# Altium schematic sheet mx8m_dram.SchDoc
size A3; SheetNumber: 5; SheetTotal: 15
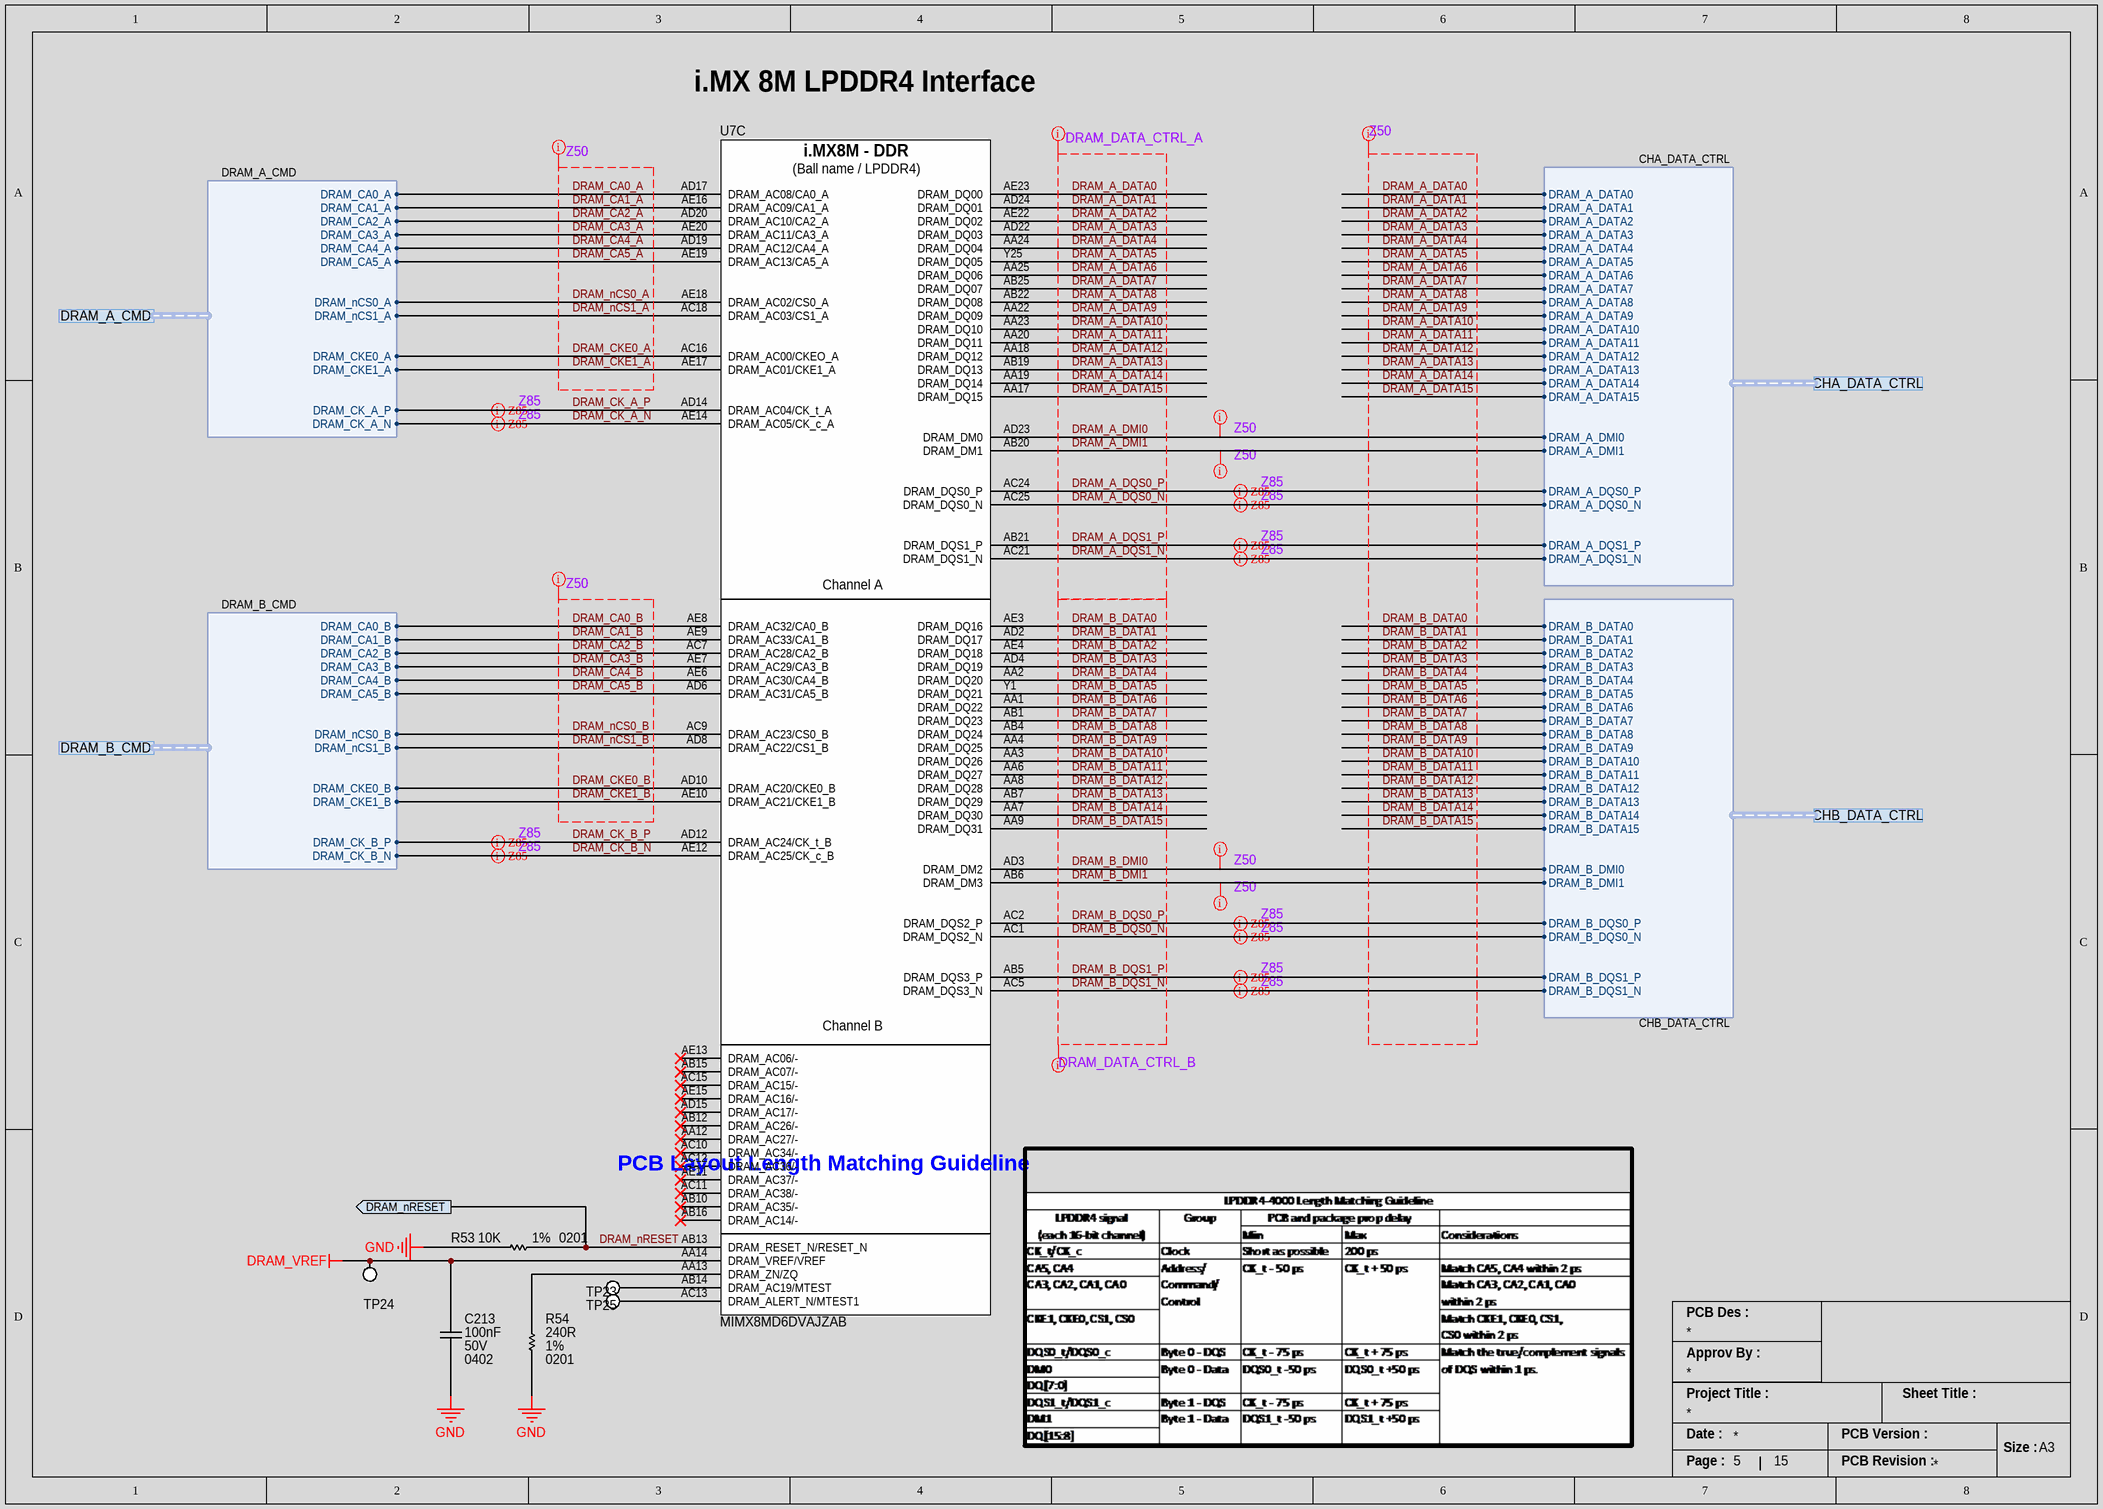
[diagram p0: mx8m_dram.SchDoc]

## Parts
C213  Voltage Rating: 50V  Capacitance: 100nF  Case/Package: 0402  [CAP_0402_CAPC1005X05N]  (hidden comment: GRM155R71H104KE14D)
R53  Tolerance: 1%  Resistance: 10K  Case Code (Imperial): 0201  [RES_0201_RESC0603X02N]  (hidden comment: RC0201FR-0710KL)
R54  Tolerance: 1%  Resistance: 240R  Case/Package: 0201  [RES_0201_RESC0603X02N]  (hidden comment: RC0201FR-07240RL)
TP23  NO COMPONENT  [TP_PAD_1.6MM_SMD_ROUND]  (value not drawn)  (no BOM)
TP24  NO COMPONENT  [TP_PAD_1.6MM_SMD_ROUND]  (value not drawn)  (no BOM)
TP25  NO COMPONENT  [TP_PAD_1.6MM_SMD_ROUND]  (value not drawn)  (no BOM)
U7  MIMX8MD6DVAJZAB  [IC_MPU_BGA621C65P25X25_1700X1700X218]  (part C of 14)

## Ports
CHA_DATA_CTRL (harness CHA_DATA_CTRL), CHB_DATA_CTRL (harness CHB_DATA_CTRL), DRAM_A_CMD (harness DRAM_A_CMD), DRAM_B_CMD (harness DRAM_B_CMD), DRAM_nRESET (out)

## Harnesses
DRAM_A_CMD: DRAM_CA0_A, DRAM_CA1_A, DRAM_CA2_A, DRAM_CA3_A, DRAM_CA4_A, DRAM_CA5_A, DRAM_nCS0_A, DRAM_nCS1_A, DRAM_CKE0_A, DRAM_CKE1_A, DRAM_CK_A_P, DRAM_CK_A_N
DRAM_B_CMD: DRAM_CA0_B, DRAM_CA1_B, DRAM_CA2_B, DRAM_CA3_B, DRAM_CA4_B, DRAM_CA5_B, DRAM_nCS0_B, DRAM_nCS1_B, DRAM_CKE0_B, DRAM_CKE1_B, DRAM_CK_B_P, DRAM_CK_B_N
CHA_DATA_CTRL: DRAM_A_DATA0, DRAM_A_DATA1, DRAM_A_DATA2, DRAM_A_DATA3, DRAM_A_DATA4, DRAM_A_DATA5, DRAM_A_DATA6, DRAM_A_DATA7, DRAM_A_DATA8, DRAM_A_DATA9, DRAM_A_DATA10, DRAM_A_DATA11, DRAM_A_DATA12, DRAM_A_DATA13, DRAM_A_DATA14, DRAM_A_DATA15, DRAM_A_DMI0, DRAM_A_DMI1, DRAM_A_DQS0_P, DRAM_A_DQS0_N, DRAM_A_DQS1_P, DRAM_A_DQS1_N
CHB_DATA_CTRL: DRAM_B_DATA0, DRAM_B_DATA1, DRAM_B_DATA2, DRAM_B_DATA3, DRAM_B_DATA4, DRAM_B_DATA5, DRAM_B_DATA6, DRAM_B_DATA7, DRAM_B_DATA8, DRAM_B_DATA9, DRAM_B_DATA10, DRAM_B_DATA11, DRAM_B_DATA12, DRAM_B_DATA13, DRAM_B_DATA14, DRAM_B_DATA15, DRAM_B_DMI0, DRAM_B_DMI1, DRAM_B_DQS0_P, DRAM_B_DQS0_N, DRAM_B_DQS1_P, DRAM_B_DQS1_N

## Nets
DRAM_VREF: C213.2 TP24.1 U7.AA14(DRAM_VREF/VREF)
GND: C213.1 R53.1 R54.1
DRAM_A_DATA0: U7.AE23(DRAM_DQ00) ; port CHA_DATA_CTRL.DRAM_A_DATA0
DRAM_A_DATA1: U7.AD24(DRAM_DQ01) ; port CHA_DATA_CTRL.DRAM_A_DATA1
DRAM_A_DATA2: U7.AE22(DRAM_DQ02) ; port CHA_DATA_CTRL.DRAM_A_DATA2
DRAM_A_DATA3: U7.AD22(DRAM_DQ03) ; port CHA_DATA_CTRL.DRAM_A_DATA3
DRAM_A_DATA4: U7.AA24(DRAM_DQ04) ; port CHA_DATA_CTRL.DRAM_A_DATA4
DRAM_A_DATA5: U7.Y25(DRAM_DQ05) ; port CHA_DATA_CTRL.DRAM_A_DATA5
DRAM_A_DATA6: U7.AA25(DRAM_DQ06) ; port CHA_DATA_CTRL.DRAM_A_DATA6
DRAM_A_DATA7: U7.AB25(DRAM_DQ07) ; port CHA_DATA_CTRL.DRAM_A_DATA7
DRAM_A_DATA8: U7.AB22(DRAM_DQ08) ; port CHA_DATA_CTRL.DRAM_A_DATA8
DRAM_A_DATA9: U7.AA22(DRAM_DQ09) ; port CHA_DATA_CTRL.DRAM_A_DATA9
DRAM_A_DATA10: U7.AA23(DRAM_DQ10) ; port CHA_DATA_CTRL.DRAM_A_DATA10
DRAM_A_DATA11: U7.AA20(DRAM_DQ11) ; port CHA_DATA_CTRL.DRAM_A_DATA11
DRAM_A_DATA12: U7.AA18(DRAM_DQ12) ; port CHA_DATA_CTRL.DRAM_A_DATA12
DRAM_A_DATA13: U7.AB19(DRAM_DQ13) ; port CHA_DATA_CTRL.DRAM_A_DATA13
DRAM_A_DATA14: U7.AA19(DRAM_DQ14) ; port CHA_DATA_CTRL.DRAM_A_DATA14
DRAM_A_DATA15: U7.AA17(DRAM_DQ15) ; port CHA_DATA_CTRL.DRAM_A_DATA15
DRAM_A_DMI0: U7.AD23(DRAM_DM0) ; port CHA_DATA_CTRL.DRAM_A_DMI0
DRAM_A_DMI1: U7.AB20(DRAM_DM1) ; port CHA_DATA_CTRL.DRAM_A_DMI1
DRAM_A_DQS0_N: U7.AC25(DRAM_DQS0_N) ; port CHA_DATA_CTRL.DRAM_A_DQS0_N
DRAM_A_DQS0_P: U7.AC24(DRAM_DQS0_P) ; port CHA_DATA_CTRL.DRAM_A_DQS0_P
DRAM_A_DQS1_N: U7.AC21(DRAM_DQS1_N) ; port CHA_DATA_CTRL.DRAM_A_DQS1_N
DRAM_A_DQS1_P: U7.AB21(DRAM_DQS1_P) ; port CHA_DATA_CTRL.DRAM_A_DQS1_P
DRAM_B_DATA0: U7.AE3(DRAM_DQ16) ; port CHB_DATA_CTRL.DRAM_B_DATA0
DRAM_B_DATA1: U7.AD2(DRAM_DQ17) ; port CHB_DATA_CTRL.DRAM_B_DATA1
DRAM_B_DATA2: U7.AE4(DRAM_DQ18) ; port CHB_DATA_CTRL.DRAM_B_DATA2
DRAM_B_DATA3: U7.AD4(DRAM_DQ19) ; port CHB_DATA_CTRL.DRAM_B_DATA3
DRAM_B_DATA4: U7.AA2(DRAM_DQ20) ; port CHB_DATA_CTRL.DRAM_B_DATA4
DRAM_B_DATA5: U7.Y1(DRAM_DQ21) ; port CHB_DATA_CTRL.DRAM_B_DATA5
DRAM_B_DATA6: U7.AA1(DRAM_DQ22) ; port CHB_DATA_CTRL.DRAM_B_DATA6
DRAM_B_DATA7: U7.AB1(DRAM_DQ23) ; port CHB_DATA_CTRL.DRAM_B_DATA7
DRAM_B_DATA8: U7.AB4(DRAM_DQ24) ; port CHB_DATA_CTRL.DRAM_B_DATA8
DRAM_B_DATA9: U7.AA4(DRAM_DQ25) ; port CHB_DATA_CTRL.DRAM_B_DATA9
DRAM_B_DATA10: U7.AA3(DRAM_DQ26) ; port CHB_DATA_CTRL.DRAM_B_DATA10
DRAM_B_DATA11: U7.AA6(DRAM_DQ27) ; port CHB_DATA_CTRL.DRAM_B_DATA11
DRAM_B_DATA12: U7.AA8(DRAM_DQ28) ; port CHB_DATA_CTRL.DRAM_B_DATA12
DRAM_B_DATA13: U7.AB7(DRAM_DQ29) ; port CHB_DATA_CTRL.DRAM_B_DATA13
DRAM_B_DATA14: U7.AA7(DRAM_DQ30) ; port CHB_DATA_CTRL.DRAM_B_DATA14
DRAM_B_DATA15: U7.AA9(DRAM_DQ31) ; port CHB_DATA_CTRL.DRAM_B_DATA15
DRAM_B_DMI0: U7.AD3(DRAM_DM2) ; port CHB_DATA_CTRL.DRAM_B_DMI0
DRAM_B_DMI1: U7.AB6(DRAM_DM3) ; port CHB_DATA_CTRL.DRAM_B_DMI1
DRAM_B_DQS0_N: U7.AC1(DRAM_DQS2_N) ; port CHB_DATA_CTRL.DRAM_B_DQS0_N
DRAM_B_DQS0_P: U7.AC2(DRAM_DQS2_P) ; port CHB_DATA_CTRL.DRAM_B_DQS0_P
DRAM_B_DQS1_N: U7.AC5(DRAM_DQS3_N) ; port CHB_DATA_CTRL.DRAM_B_DQS1_N
DRAM_B_DQS1_P: U7.AB5(DRAM_DQS3_P) ; port CHB_DATA_CTRL.DRAM_B_DQS1_P
DRAM_CA0_A: U7.AD17(DRAM_AC08/CA0_A) ; port DRAM_A_CMD.DRAM_CA0_A
DRAM_CA0_B: U7.AE8(DRAM_AC32/CA0_B) ; port DRAM_B_CMD.DRAM_CA0_B
DRAM_CA1_A: U7.AE16(DRAM_AC09/CA1_A) ; port DRAM_A_CMD.DRAM_CA1_A
DRAM_CA1_B: U7.AE9(DRAM_AC33/CA1_B) ; port DRAM_B_CMD.DRAM_CA1_B
DRAM_CA2_A: U7.AD20(DRAM_AC10/CA2_A) ; port DRAM_A_CMD.DRAM_CA2_A
DRAM_CA2_B: U7.AC7(DRAM_AC28/CA2_B) ; port DRAM_B_CMD.DRAM_CA2_B
DRAM_CA3_A: U7.AE20(DRAM_AC11/CA3_A) ; port DRAM_A_CMD.DRAM_CA3_A
DRAM_CA3_B: U7.AE7(DRAM_AC29/CA3_B) ; port DRAM_B_CMD.DRAM_CA3_B
DRAM_CA4_A: U7.AD19(DRAM_AC12/CA4_A) ; port DRAM_A_CMD.DRAM_CA4_A
DRAM_CA4_B: U7.AE6(DRAM_AC30/CA4_B) ; port DRAM_B_CMD.DRAM_CA4_B
DRAM_CA5_A: U7.AE19(DRAM_AC13/CA5_A) ; port DRAM_A_CMD.DRAM_CA5_A
DRAM_CA5_B: U7.AD6(DRAM_AC31/CA5_B) ; port DRAM_B_CMD.DRAM_CA5_B
DRAM_CK_A_N: U7.AE14(DRAM_AC05/CK_c_A) ; port DRAM_A_CMD.DRAM_CK_A_N
DRAM_CK_A_P: U7.AD14(DRAM_AC04/CK_t_A) ; port DRAM_A_CMD.DRAM_CK_A_P
DRAM_CK_B_N: U7.AE12(DRAM_AC25/CK_c_B) ; port DRAM_B_CMD.DRAM_CK_B_N
DRAM_CK_B_P: U7.AD12(DRAM_AC24/CK_t_B) ; port DRAM_B_CMD.DRAM_CK_B_P
DRAM_CKE0_A: U7.AC16(DRAM_AC00/CKEO_A) ; port DRAM_A_CMD.DRAM_CKE0_A
DRAM_CKE0_B: U7.AD10(DRAM_AC20/CKE0_B) ; port DRAM_B_CMD.DRAM_CKE0_B
DRAM_CKE1_A: U7.AE17(DRAM_AC01/CKE1_A) ; port DRAM_A_CMD.DRAM_CKE1_A
DRAM_CKE1_B: U7.AE10(DRAM_AC21/CKE1_B) ; port DRAM_B_CMD.DRAM_CKE1_B
DRAM_nCS0_A: U7.AE18(DRAM_AC02/CS0_A) ; port DRAM_A_CMD.DRAM_nCS0_A
DRAM_nCS0_B: U7.AC9(DRAM_AC23/CS0_B) ; port DRAM_B_CMD.DRAM_nCS0_B
DRAM_nCS1_A: U7.AC18(DRAM_AC03/CS1_A) ; port DRAM_A_CMD.DRAM_nCS1_A
DRAM_nCS1_B: U7.AD8(DRAM_AC22/CS1_B) ; port DRAM_B_CMD.DRAM_nCS1_B
DRAM_nRESET: R53.2 U7.AB13(DRAM_RESET_N/RESET_N) ; port DRAM_nRESET
NetR54_2: R54.2 U7.AA13(DRAM_ZN/ZQ)
NetTP23_1: TP23.1 U7.AB14(DRAM_AC19/MTEST)
NetTP25_1: TP25.1 U7.AC13(DRAM_ALERT_N/MTEST1)

Not connected (* = marked no-connect by the designer): U7 AA12(DRAM_AC27/-)* AB10(DRAM_AC35/-)* AB12(DRAM_AC26/-)* AB15(DRAM_AC07/-)* AB16(DRAM_AC14/-)* AC10(DRAM_AC34/-)* AC11(DRAM_AC38/-)* AC12(DRAM_AC36/-)* AC15(DRAM_AC15/-)* AD15(DRAM_AC17/-)* AE11(DRAM_AC37/-)* AE13(DRAM_AC06/-)* AE15(DRAM_AC16/-)*

## Layout directives
differential pair; net class Z85; differential pair class Z85: DRAM_A_DQS0_N, DRAM_A_DQS0_P, DRAM_A_DQS1_N, DRAM_A_DQS1_P, DRAM_B_DQS0_N, DRAM_B_DQS0_P, DRAM_B_DQS1_N, DRAM_B_DQS1_P, DRAM_CK_A_N, DRAM_CK_A_P, DRAM_CK_B_N, DRAM_CK_B_P
net class Z50: DRAM_A_DATA0, DRAM_A_DATA1, DRAM_A_DATA2, DRAM_A_DATA3, DRAM_A_DATA4, DRAM_A_DATA5, DRAM_A_DATA6, DRAM_A_DATA7, DRAM_A_DATA8, DRAM_A_DATA9, DRAM_A_DATA10, DRAM_A_DATA11, DRAM_A_DATA12, DRAM_A_DATA13, DRAM_A_DATA14, DRAM_A_DATA15, DRAM_A_DMI0, DRAM_A_DMI1, DRAM_B_DATA0, DRAM_B_DATA1, DRAM_B_DATA2, DRAM_B_DATA3, DRAM_B_DATA4, DRAM_B_DATA5, DRAM_B_DATA6, DRAM_B_DATA7, DRAM_B_DATA8, DRAM_B_DATA9, DRAM_B_DATA10, DRAM_B_DATA11, DRAM_B_DATA12, DRAM_B_DATA13, DRAM_B_DATA14, DRAM_B_DATA15, DRAM_B_DMI0, DRAM_B_DMI1, DRAM_CA0_A, DRAM_CA0_B, DRAM_CA1_A, DRAM_CA1_B, DRAM_CA2_A, DRAM_CA2_B, DRAM_CA3_A, DRAM_CA3_B, DRAM_CA4_A, DRAM_CA4_B, DRAM_CA5_A, DRAM_CA5_B, DRAM_CKE0_A, DRAM_CKE0_B, DRAM_CKE1_A, DRAM_CKE1_B, DRAM_nCS0_A, DRAM_nCS0_B, DRAM_nCS1_A, DRAM_nCS1_B
net class DRAM_DATA_CTRL_A: DRAM_A_DATA0, DRAM_A_DATA1, DRAM_A_DATA2, DRAM_A_DATA3, DRAM_A_DATA4, DRAM_A_DATA5, DRAM_A_DATA6, DRAM_A_DATA7, DRAM_A_DATA8, DRAM_A_DATA9, DRAM_A_DATA10, DRAM_A_DATA11, DRAM_A_DATA12, DRAM_A_DATA13, DRAM_A_DATA14, DRAM_A_DATA15, DRAM_A_DMI0, DRAM_A_DMI1, DRAM_A_DQS0_N, DRAM_A_DQS0_P, DRAM_A_DQS1_N, DRAM_A_DQS1_P
net class DRAM_DATA_CTRL_B: DRAM_B_DATA0, DRAM_B_DATA1, DRAM_B_DATA2, DRAM_B_DATA3, DRAM_B_DATA4, DRAM_B_DATA5, DRAM_B_DATA6, DRAM_B_DATA7, DRAM_B_DATA8, DRAM_B_DATA9, DRAM_B_DATA10, DRAM_B_DATA11, DRAM_B_DATA12, DRAM_B_DATA13, DRAM_B_DATA14, DRAM_B_DATA15, DRAM_B_DMI0, DRAM_B_DMI1, DRAM_B_DQS0_N, DRAM_B_DQS0_P, DRAM_B_DQS1_N, DRAM_B_DQS1_P

## Notes on the sheet
- i.MX 8M LPDDR4 Interface
- (near U7) PCB Layout Length Matching Guideline
- PCB Des :
- Approv By :
- Project Title :
- Sheet Title :
- Date :
- PCB Version :
- Size :
- A3
- Page :
- PCB Revision :
- (in symbol IC_MPU_ARM_1.5GHZ_MIMX8MD6DVAJZAB, part C) i.MX8M - DDR; (Ball name / LPDDR4); Channel A; Channel B

## Library data of the parts
C213 = CAP_100NF_50V_X7R_0402: Multilayer Ceramic Capacitor, 0.1 uF, 16 V, ± 10%, X7R, 0402 [1005 Metric]; Manufacturer: Murata; Dissipation Factor: 0.025%; Temperature Coefficient: 30ppm/°C; Supplier 1: DigiKey; Manufacturer Part Number: GRM155R71H104KE14D; RoHS: Yes; Category: Ceramic Capacitors; Stock 1: 13730790; Pricing 1: 1=0.1, 10=0.023, 50=0.0132, 100=0.0102, 500=0.00768, 1000=0.00603, 2500=0.00548, 5000=0.00504 (USD); Mount: Surface Mount; Number of Pins: 2NUMBER; Case Code (Metric): 1005; Material: Ceramic; Case Code (Imperial): 0402; Weight: 0.000212oz; Dielectric Material: Ceramic; Min Operating Temperature: -55°C; Max Operating Temperature: 125°C; Packaging: Tape and Reel; Package Quantity: 10000; Series: GRM; Tolerance: 10%; Dielectric: X7R; Termination: SMD/SMT; Voltage: 50V; Voltage Rating (DC): 50V; Construction: Flat; Length: 1mm; Width: 0.5mm; Height: 0.5mm; Depth: 0.5mm; Thickness: 0.022inch; Reach SVHC Compliant: No; RoHS Compliant: Yes; Lead Free: 5697LeadFree; ComponentLink1URL: http://www.farnell.com/datasheets/2079156.pdf?src-supplier=Farnell; ComponentLink1Description: http://www.farnell.com/datasheets/2079156.pdf?src-supplier=Farnell; ComponentLink2URL: http://www.mouser.com/ds/2/281/c02e-2905.pdf?src-supplier=Mouser; ComponentLink2Description: http://www.mouser.com/ds/2/281/c02e-2905.pdf?src-supplier=Mouser; ComponentLink3URL: http://www.farnell.com/datasheets/2079156.pdf?src-supplier=Newark; ComponentLink3Description: http://www.farnell.com/datasheets/2079156.pdf?src-supplier=Newark; ComponentLink4URL: https://datasheet.octopart.com/GRM155R71H104KE14D-Murata-datasheet-22122223.pdf?src-supplier=Future+Electronics; ComponentLink4Description: https://datasheet.octopart.com/GRM155R71H104KE14D-Murata-datasheet-22122223.pdf?src-supplier=Future+Electronics; ComponentLink5URL: https://search.murata.co.jp/Ceramy/image/img/A01X/G101/ENG/GRM155R71H104KE14-01.pdf?src-supplier=Digi-Key; ComponentLink5Description: https://search.murata.co.jp/Ceramy/image/img/A01X/G101/ENG/GRM155R71H104KE14-01.pdf?src-supplier=Digi-Key; ComponentLink6URL: http://psearch.en.murata.com/capacitor/product/GRM155R71H104KE14%23.pdf?src-supplier=Avnet; ComponentLink6Description: http://psearch.en.murata.com/capacitor/product/GRM155R71H104KE14%23.pdf?src-supplier=Avnet; ComponentLink7URL: https://datasheet.octopart.com/GRM155R71H104KE14D-Murata-datasheet-66077078.pdf?src-supplier=Element14; ComponentLink7Description: https://datasheet.octopart.com/GRM155R71H104KE14D-Murata-datasheet-66077078.pdf?src-supplier=Element14; Supplier Part Number 1: 490-10700-6-ND; Supplier 2: Digikey; Stock 2: 3706055; Pricing 2: 1=0.1, 10=0.037, 50=0.021, 100=0.0162, 500=0.01224, 1000=0.00961, 2500=0.00874, 5000=0.00804 (USD); Halogen Free: 5694HalogenFree; ComponentLink8URL: http://www.mouser.com/ds/2/447/UPY-GPHC_X5R_4V-to-50V_25-1131599.pdf?src-supplier=Mouser; ComponentLink8Description: http://www.mouser.com/ds/2/447/UPY-GPHC_X5R_4V-to-50V_25-1131599.pdf?src-supplier=Mouser; ComponentLink9URL: https://datasheet.octopart.com/CC0402KRX5R8BB104-Yageo-datasheet-137700082.pdf?src-supplier=Future+Electronics; ComponentLink9Description: https://datasheet.octopart.com/CC0402KRX5R8BB104-Yageo-datasheet-137700082.pdf?src-supplier=Future+Electronics; ComponentLink10URL: http://www.yageo.com/documents/recent/UPY-GPHC_X5R_4V-to-50V_25.pdf?src-supplier=Digikey; ComponentLink10Description: http://www.yageo.com/documents/recent/UPY-GPHC_X5R_4V-to-50V_25.pdf?src-supplier=Digikey; ComponentLink11URL: https://datasheet.octopart.com/CC0402KRX5R8BB104-Yageo-datasheet-140260304.pdf?src-supplier=Newark; ComponentLink11Description: https://datasheet.octopart.com/CC0402KRX5R8BB104-Yageo-datasheet-140260304.pdf?src-supplier=Newark; ComponentLink12URL: https://datasheet.octopart.com/CC0402KRX5R8BB104-Yageo-datasheet-170350636.pdf?src-supplier=Future+Electronics; ComponentLink12Description: https://datasheet.octopart.com/CC0402KRX5R8BB104-Yageo-datasheet-170350636.pdf?src-supplier=Future+Electronics; ComponentLink13URL: http://www.yageo.com/documents/recent/UPY-GPHC_X5R_4V-to-50V-16.pdf?src-supplier=Future+Electronics; ComponentLink13Description: http://www.yageo.com/documents/recent/UPY-GPHC_X5R_4V-to-50V-16.pdf?src-supplier=Future+Electronics; Supplier Part Number 2: 311-1697-1-ND
R53 = RES_10K_1/12W_1%_0201: SMD Chip Resistor, 10 kOhm, ± 1%, 50 mW, 0201 [0603 Metric], Thick Film, General Purpose; Manufacturer: Yageo; Temperature Coefficient: 200ppm/°C; Power Rating: 50mW; Voltage Rating: 25V; Supplier 1: Digikey; Manufacturer Part Number: RC0201FR-0710KL; RoHS: Yes; Category: Chip SMD Resistors; Stock 1: 12030325; Pricing 1: 1=0.1, 10=0.027, 50=0.0172, 100=0.0143, 500=0.00988, 1000=0.00854, 5000=0.00629 (USD); Case/Package: 0201; Number of Pins: 2NUMBER; Contact Plating: Tin,Matte; Case Code (Metric): 0603; Weight: 6E-06oz; Min Operating Temperature: -55°C; Max Operating Temperature: 125°C; Packaging: Tape and Reel; Package Quantity: 10000; Termination: SMD/SMT; Resistor Type: Thick Film; Series: RC; Number of Terminations: 2; Max Power Dissipation: 50mW; Working Voltage: 25V; Features: Moisture Resistant; Technology: THICK FILM; Resistance Tolerance: 1%; Construction: Rectangular; Voltage Rating (DC): 25V; Length: 0.6mm; Width: 0.012inch; Height: 0.01inch; Depth: 0.3mm; RoHS Compliant: Yes; Reach SVHC Compliant: No; Military Standard: Not; Lead Free: 5697LeadFree; ComponentLink1URL: https://datasheet.ciiva.com/7660/1421516-7660807.pdf?src-supplier=Element14; ComponentLink1Description: https://datasheet.ciiva.com/7660/1421516-7660807.pdf?src-supplier=Element14; ComponentLink2URL: https://datasheet.ciiva.com/46391/1421516-46391339.pdf?src-supplier=Element14; ComponentLink2Description: https://datasheet.ciiva.com/46391/1421516-46391339.pdf?src-supplier=Element14; ComponentLink3URL: https://datasheet.ciiva.com/2467/pyu-r-int-thick-7-2467110.pdf?src-supplier=Digikey; ComponentLink3Description: https://datasheet.ciiva.com/2467/pyu-r-int-thick-7-2467110.pdf?src-supplier=Digikey; ComponentLink4URL: https://datasheet.ciiva.com/2467/pyu-r-int-thick-7-2467111.pdf?src-supplier=Digikey; ComponentLink4Description: https://datasheet.ciiva.com/2467/pyu-r-int-thick-7-2467111.pdf?src-supplier=Digikey; ComponentLink5URL: https://datasheet.ciiva.com/2467/pyu-r-int-thick-7-2467109.pdf?src-supplier=Digikey; ComponentLink5Description: https://datasheet.ciiva.com/2467/pyu-r-int-thick-7-2467109.pdf?src-supplier=Digikey; ComponentLink6URL: https://datasheet.ciiva.com/26829/getdatasheetpartid-421074-26829851.pdf?src-supplier=Verical; ComponentLink6Description: https://datasheet.ciiva.com/26829/getdatasheetpartid-421074-26829851.pdf?src-supplier=Verical; ComponentLink7URL: https://datasheet.ciiva.com/8891/pyu-rc0201-51-rohs-l-8-8891384.pdf?src-supplier=Avnet; ComponentLink7Description: https://datasheet.ciiva.com/8891/pyu-rc0201-51-rohs-l-8-8891384.pdf?src-supplier=Avnet; Supplier Part Number 1: 311-10.0KMCT-ND
R54 = RES_240R_1%_50mW_0201: SMD Chip Resistor, 240 Ohm, ± 1%, 50 mW, 0201 [0603 Metric], Thick Film, General Purpose; Manufacturer: Yageo; Power Rating: 50mW; Temperature Coefficient: 200ppm/°C; Supplier 1: Digikey; Manufacturer Part Number: RC0201FR-07240RL; RoHS: Yes; Category: Chip SMD Resistors; Stock 1: 736295; Pricing 1: 1=0.1, 10=0.027, 50=0.0172, 100=0.0143, 500=0.00988, 1000=0.00854, 5000=0.00629 (USD); Mount: Surface Mount; Case Code (Metric): 0603; Case Code (Imperial): 0201; Size Code: 0201; Min Operating Temperature: -55°C; Max Operating Temperature: 125°C; Packaging: Cut Tape; Number of Terminations: 2; Max Power Dissipation: 50mW; Features: Moisture Resistant; Series: RC; Lead Free: Lead Free; RoHS Compliant: Yes; ComponentLink1URL: https://datasheet.octopart.com/RC0201FR-07240RL-Yageo-datasheet-164759695.pdf?src-supplier=Future+Electronics; ComponentLink1Description: https://datasheet.octopart.com/RC0201FR-07240RL-Yageo-datasheet-164759695.pdf?src-supplier=Future+Electronics; ComponentLink2URL: http://www.yageo.com/documents/recent/PYu-RC0201_51_RoHS_L_(8).pdf?src-supplier=Future+Electronics; ComponentLink2Description: http://www.yageo.com/documents/recent/PYu-RC0201_51_RoHS_L_(8).pdf?src-supplier=Future+Electronics; ComponentLink3URL: https://datasheet.octopart.com/RC0201FR-07240RL-Yageo-datasheet-148775077.pdf?src-supplier=TME; ComponentLink3Description: https://datasheet.octopart.com/RC0201FR-07240RL-Yageo-datasheet-148775077.pdf?src-supplier=TME; Supplier Part Number 1: YAG2528DKR-ND
TP23-TP25 = TP_PAD_SMD_Round: Test Point, SMD pad, round, 1.5mm, 1.6mm, 3mm diameter
U7 = IC_MPU_ARM_1.5GHZ_MIMX8MD6DVAJZAB: i.MX 8M: Cortex-A53 up to 1.5GHz and Cortex-M4 / TRAY TRAY MULTIPLE DP BAKEABLE RoHS Compliant: Yes; Manufacturer: NXP Semiconductors; Supplier 1: Digikey; Manufacturer Part Number: MIMX8MD6DVAJZAB; RoHS: Yes; Category: Microprocessors; Stock 1: 162; Pricing 1: 1=56.07, 10=46.184, 25=43.716, 90=41.175 (USD); RoHS Compliant: Yes; Supplier Part Number 1: 568-14717-ND